# EAGLE design ADT7410_termometr2_minibord (EAGLE 6.3)
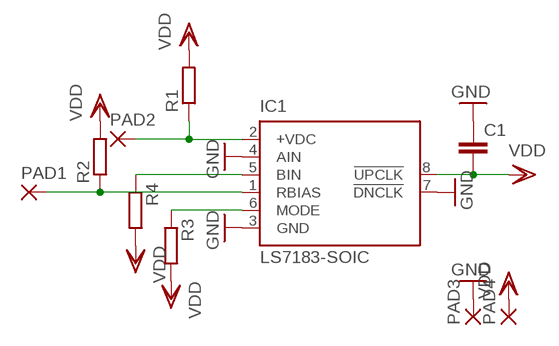
[diagram p0: schematic, sheet 1]

## Parts
C1  C-EUC0805  [C0805]
IC1  LS7183-SOIC  [SOIC08]
PAD1  1,6/0,8  [1,6/0,8]
PAD2  1,6/0,8  [1,6/0,8]
PAD3  1,6/0,8  [1,6/0,8]
PAD4  1,6/0,8  [1,6/0,8]
R1  R-EU_M0805  [M0805]
R2  R-EU_M0805  [M0805]
R3  R-EU_M0805  [M0805]
R4  R-EU_M0805  [M0805]

## Nets
GND: C1.1 IC1.3(GND) IC1.4(AIN) IC1.7(!DNCLK) PAD3.1(P)
N$1: IC1.1(RBIAS) PAD1.1(P) R2.1
N$2: IC1.2(+VDC) PAD2.1(P) R1.1
N$3: IC1.5(BIN) R4.1
N$4: IC1.6(MODE) R3.1
VDD: C1.2 IC1.8(!UPCLK) PAD4.1(P) R1.2 R2.2 R3.2 R4.2

## Library data of the parts
C1 = rcl:C-EU: CAPACITOR, European symbol
IC1 = optocoupler:LS7183: Encoder to Counter Interface Source: http://www.usdigital.com/products/ls7183-ls7184/ls7183 ls7184 Data Sheet.pdf; OC_FARNELL: unknown; OC_NEWARK: unknown
PAD1-PAD4 = wirepad:1,6/0,8: THROUGH-HOLE PAD
R1-R4 = rcl:R-EU_: RESISTOR, European symbol

## Net classes
0 default: clearance 0.75 mm

## Board
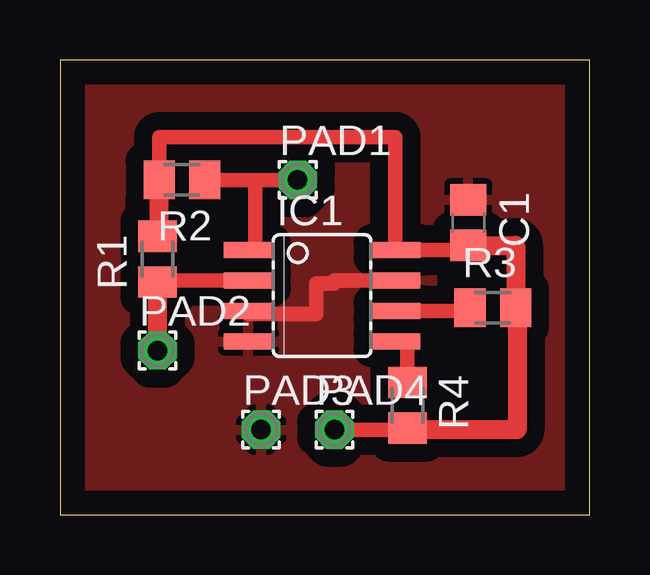
[diagram p1: board, top side]

Size 22.08 x 18.97 mm. Coordinates in mm from the lower left corner, seen from the top.
Outline: 0,0 22.08,0 22.08,18.97 0,18.97 0,0
Copper layers (1*16): Top 0.035mm / dielectric 1.5mm / Bottom 0.035mm
Design rules "default": minimum track width 10mil, minimum drill 24mil, track to track 8mil, track to pad 8mil, pad to pad 8mil, via to via 8mil, smd to smd 8mil, copper to edge 40mil, drill to drill 8mil, minimum pad ring 10mil, minimum via ring 8mil, stop-mask expansion 4mil, vias tented up to drill 0mil, thermal gap 10mil

### Footprints (pad centres in the part's own frame; a part is rotated, then mirrored left to right if it is on the bottom)
C0805 = smd 1.3 x 1.5: 1 -0.95,0; 2 0.95,0
SOIC08 = smd 0.66 x 2.032: 1 -1.905,-3.073; 2 -0.635,-3.073; 3 0.635,-3.073; 4 1.905,-3.073; 5 1.905,3.073; 6 0.635,3.073; 7 -0.635,3.073; 8 -1.905,3.073
1,6/0,8 = drill 0.813 pad 1.6 octagon: 1 0,0
M0805 = smd 1.3 x 1.6: 1 -0.95,0; 2 0.95,0

### Placement (x,y rotation side)
C1  17.02,12.19 270 top
IC1  10.92,9.14 270 top
PAD1  9.91,13.97 0 top
PAD2  4.06,6.86 0 top
PAD3  8.38,3.56 0 top
PAD4  11.43,3.56 0 top
R1  4.06,10.67 90 top
R2  5.08,13.97 180 top
R3  18.03,8.64 0 top
R4  14.48,4.57 270 top

### Tracks (layer width: path | path; a pad name or v marks a point on that pad's centre or on a via)
GND
  Top 0.6: IC1.7 11.43,9.78 11.43,9.65 10.67,9.65 10.67,8.38 7.85,8.38 IC1.3
  pour Top: -7.37,-3.81 33.02,-3.81 33.02,23.37 -7.37,23.37
N$1
  Top 0.6: IC1.1 8.13,11.05 8.13,13.97 | 8.13,13.97 R2.1 | PAD1.1 8.13,13.97
N$2
  Top 0.6: IC1.2 4.06,9.78 R1.1
  Top 0.8: PAD2.1 R1.1
N$3
  Top 0.6: IC1.5 14.48,7.24 R4.1
N$4
  Top 0.6: IC1.6 17.08,8.51 R3.1
VDD
  Top 0.6: C1.2 17.02,11.05 IC1.8 13.97,11.05 13.97,15.75 4.13,15.75 R2.2 | PAD4.1 14.48,3.56
  Top 0.8: R1.2 4.13,11.62 R2.2 | C1.2 18.98,11.24 R3.2 19.05,8.64 19.05,3.56 14.48,3.56 R4.2